# EAGLE design led_board (EAGLE 7.5.0)
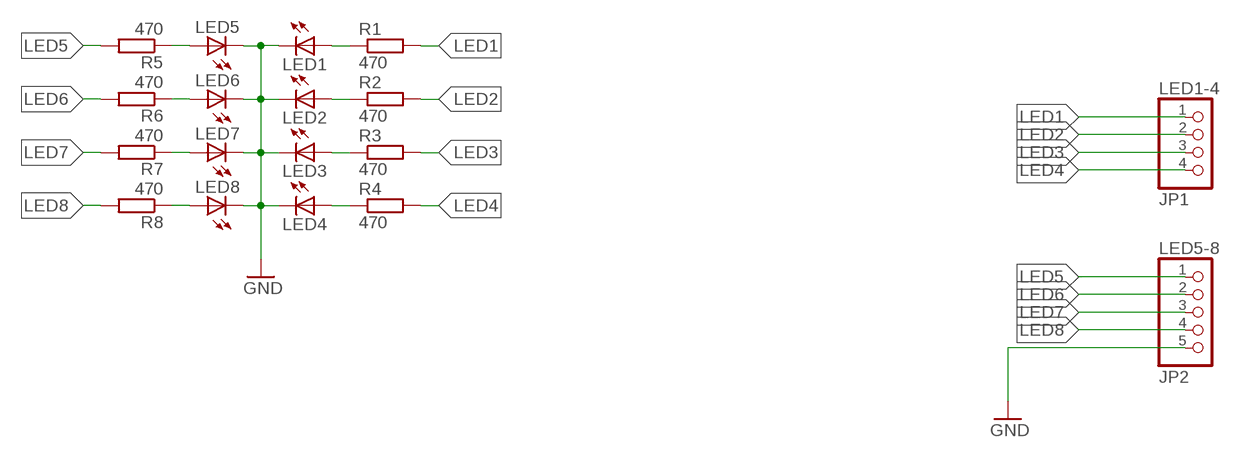
[diagram p0: schematic, sheet 1]

## Parts
LED1  LED3MM  [LED3MM]
LED1-4  JP1  PINHD-1X4  [1X04]
LED2  LED3MM  [LED3MM]
LED3  LED3MM  [LED3MM]
LED4  LED3MM  [LED3MM]
LED5  LED3MM  [LED3MM]
LED5-8  JP2  PINHD-1X5  [1X05]
LED6  LED3MM  [LED3MM]
LED7  LED3MM  [LED3MM]
LED8  LED3MM  [LED3MM]
R1  470  R-EU_R0805  [R0805]
R2  470  R-EU_R0805  [R0805]
R3  470  R-EU_R0805  [R0805]
R4  470  R-EU_R0805  [R0805]
R5  470  R-EU_R0805  [R0805]
R6  470  R-EU_R0805  [R0805]
R7  470  R-EU_R0805  [R0805]
R8  470  R-EU_R0805  [R0805]

## Nets
GND: LED1.K(C) LED2.K(C) LED3.K(C) LED4.K(C) LED5-8.5 LED5.K(C) LED6.K(C) LED7.K(C) LED8.K(C)
LED1: LED1-4.1 R1.2
LED2: LED1-4.2 R2.2
LED3: LED1-4.3 R3.2
LED4: LED1-4.4 R4.2
LED5: LED5-8.1 R5.2
LED6: LED5-8.2 R6.2
LED7: LED5-8.3 R7.2
LED8: LED5-8.4 R8.2
N$1: LED1.A R1.1
N$2: LED2.A R2.1
N$3: LED3.A R3.1
N$4: LED4.A R4.1
N$5: LED5.A R5.1
N$6: LED6.A R6.1
N$7: LED7.A R7.1
N$8: LED8.A R8.1

## Library data of the parts
LED1-LED8 = led:LED: LED OSRAM: - CHIPLED LG R971, LG N971, LY N971, LG Q971, LY Q971, LO R971, LY R971 LH N974, LH R974 LS Q976, LO Q976, LY Q976 LO Q996 - Hyper CHIPLED LW Q18S LB Q993, LB Q99A, LB R99A - SideLED LS A670, LO A670, LY A670, LG A670, LP A670 LB A673, LV A673, LT A673, LW A673 LH A674 LY A675 LS A676, LA A676, LO A676, LY A676, LW A676 LS A679, LY A679, LG A679 - Hyper Micro SIDELED® LS Y876, LA Y876, LO Y876, LY Y876 LT Y87S - SmartLED LW L88C, LW L88S LB L89C, LB L89S, LG L890 LS L89K, LO L89K, LY L89K LS L896, LA L896, LO L896, LY L896 - TOPLED LS T670, LO T670, LY T670, LG T670, LP T670 LSG T670, LSP T670, LSY T670, LOP T670, LYG T670 LG T671, LOG T671, LSG T671 LB T673, LV T673, LT T673, LW T673 LH T674 LS T676, LA T676, LO T676, LY T676, LB T676, LH T676, LSB T676, LW T676 LB T67C, LV T67C, LT T67C, LS T67K, LO T67K, LY T67K, LW E67C LS E67B, LA E67B, LO E67B, LY E67B, LB E67C, LV E67C, LT E67C LW T67C LS T679, LY T679, LG T679 LS T770, LO T770, LY T770, LG T770, LP T770 LB T773, LV T773, LT T773, LW T773 LH T774 LS E675, LA E675, LY E675, LS T675 LS T776, LA T776, LO T776, LY T776, LB T776 LHGB T686 LT T68C, LB T68C - Hyper Mini TOPLED® LB M676 - Mini TOPLED Santana® LG M470 LS M47K, LO M47K, LY M47K Source: http://www.osram.convergy.de LUXEON: - LUMILED® LXK2-PW12-R00, LXK2-PW12-S00, LXK2-PW14-U00, LXK2-PW14-V00 LXK2-PM12-R00, LXK2-PM12-S00, LXK2-PM14-U00 LXK2-PE12-Q00, LXK2-PE12-R00, LXK2-PE12-S00, LXK2-PE14-T00, LXK2-PE14-U00 LXK2-PB12-K00, LXK2-PB12-L00, LXK2-PB12-M00, LXK2-PB14-N00, LXK2-PB14-P00, LXK2-PB14-Q00 LXK2-PR12-L00, LXK2-PR12-M00, LXK2-PR14-Q00, LXK2-PR14-R00 LXK2-PD12-Q00, LXK2-PD12-R00, LXK2-PD12-S00 LXK2-PH12-R00, LXK2-PH12-S00 LXK2-PL12-P00, LXK2-PL12-Q00, LXK2-PL12-R00 Source: www.luxeon.com KINGBRIGHT: KA-3528ASYC Source: www.kingbright.com
LED1-4 = pinhead:PINHD-1X4: PIN HEADER
LED5-8 = pinhead:PINHD-1X5: PIN HEADER
R1-R8 = resistor:R-EU_: RESISTOR, European symbol

## Board
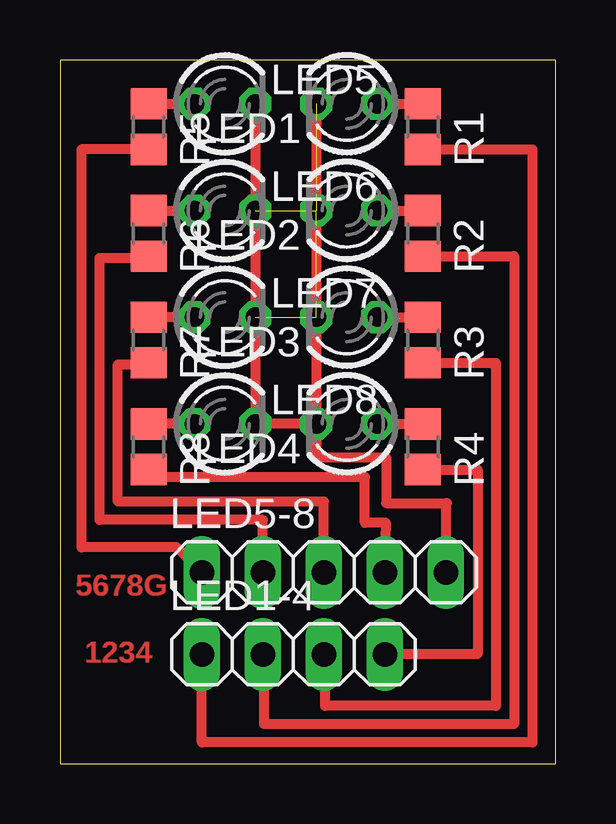
[diagram p1: board, top side]

Size 20.65 x 29.32 mm. Coordinates in mm from the lower left corner, seen from the top.
Outline: 0,0 20.65,0 20.65,29.32 0,29.32 0,0
Copper layers (1*16): Top 0.035mm / dielectric 1.5mm / Bottom 0.035mm
Design rules "default *": minimum track width 10mil, minimum drill 24mil, track to track 8mil, track to pad 8mil, pad to pad 8mil, via to via 8mil, smd to smd 8mil, copper to edge 25mil, drill to drill 8mil, minimum pad ring 10mil, minimum via ring 8mil, stop-mask expansion 4mil, vias tented up to drill 0mil, thermal gap 10mil

### Footprints (pad centres in the part's own frame; a part is rotated, then mirrored left to right if it is on the bottom)
LED3MM = drill 0.813 octagon: A -1.27,0; K 1.27,0
1X04 = drill 1.016 long: 1 -3.81,0; 2 -1.27,0; 3 1.27,0; 4 3.81,0
1X05 = drill 1.016 long: 1 -5.08,0; 2 -2.54,0; 3 0,0; 4 2.54,0; 5 5.08,0
R0805 = smd 1.3 x 1.5: 1 -0.95,0; 2 0.95,0

### Placement (x,y rotation side)
LED1  11.95,27.5 180 top
LED1-4  9.73,4.55 0 top
LED2  11.95,23.05 180 top
LED3  11.95,18.61 180 top
LED4  11.95,14.16 180 top
LED5  6.87,27.5 0 top
LED5-8  11,7.97 0 top
LED6  6.87,23.05 0 top
LED7  6.87,18.61 0 top
LED8  6.87,14.16 0 top
R1  15.12,26.54 270 top
R2  15.12,22.1 270 top
R3  15.12,17.65 270 top
R4  15.12,13.21 270 top
R5  3.69,26.54 270 top
R6  3.69,22.1 270 top
R7  3.69,17.65 270 top
R8  3.69,13.21 270 top

### Tracks (layer width: path | path; a pad name or v marks a point on that pad's centre or on a via)
GND  (4 unrouted)
  Top 0.406: LED1.K LED4.K | LED5.K LED8.K LED4.K | LED4.K 10.68,12.76 13.59,12.76 13.59,10.86 16.08,10.86 | 16.13,10.86 16.08,10.86 | 16.08,10.86 LED5-8.5
LED1
  Top 0.406: R1.2 19.68,25.59 19.68,0.89 5.92,0.89 LED1-4.1
LED2
  Top 0.406: R2.2 18.92,21.15 18.92,1.65 8.51,1.65 8.51,4.55 LED1-4.2
LED3
  Top 0.406: R3.2 18.16,16.7 18.16,2.41 11.05,2.41 11.05,4.55 LED1-4.3
LED4
  Top 0.406: R4.2 17.4,12.26 17.4,4.57 13.54,4.57 LED1-4.4
LED5
  Top 0.406: R5.2 0.89,25.59 0.89,9.02 4.87,9.02 LED5-8.1
LED6
  Top 0.406: LED5-8.2 8.46,10.16 1.65,10.16 1.65,21.08 3.69,21.08 R6.2
LED7
  Top 0.406: LED5-8.3 11,10.92 2.41,10.92 2.41,16.64 3.69,16.64 R7.2
LED8
  Top 0.406: LED5-8.4 13.59,10.03 12.7,10.03 12.7,11.94 3.69,11.94 R8.2
N$1
  Top 0.406: LED1.A R1.1
N$2
  Top 0.406: LED2.A R2.1
N$3
  Top 0.406: LED3.A R3.1
N$4
  Top 0.406: LED4.A R4.1
N$5
  Top 0.406: R5.1 LED5.A
N$6
  Top 0.406: R6.1 LED6.A
N$7
  Top 0.406: LED7.A R7.1
N$8
  Top 0.406: LED8.A R8.1

### Text on the board
Top: 5678G | 1234